# EAGLE schematic BasePCB (EAGLE 9.4.2)
Assembly variants: basic, pinout

## Sheet 1 of 2
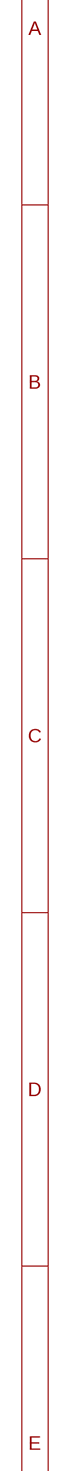
[diagram p0: schematic, sheet 1, part 1 of 2]
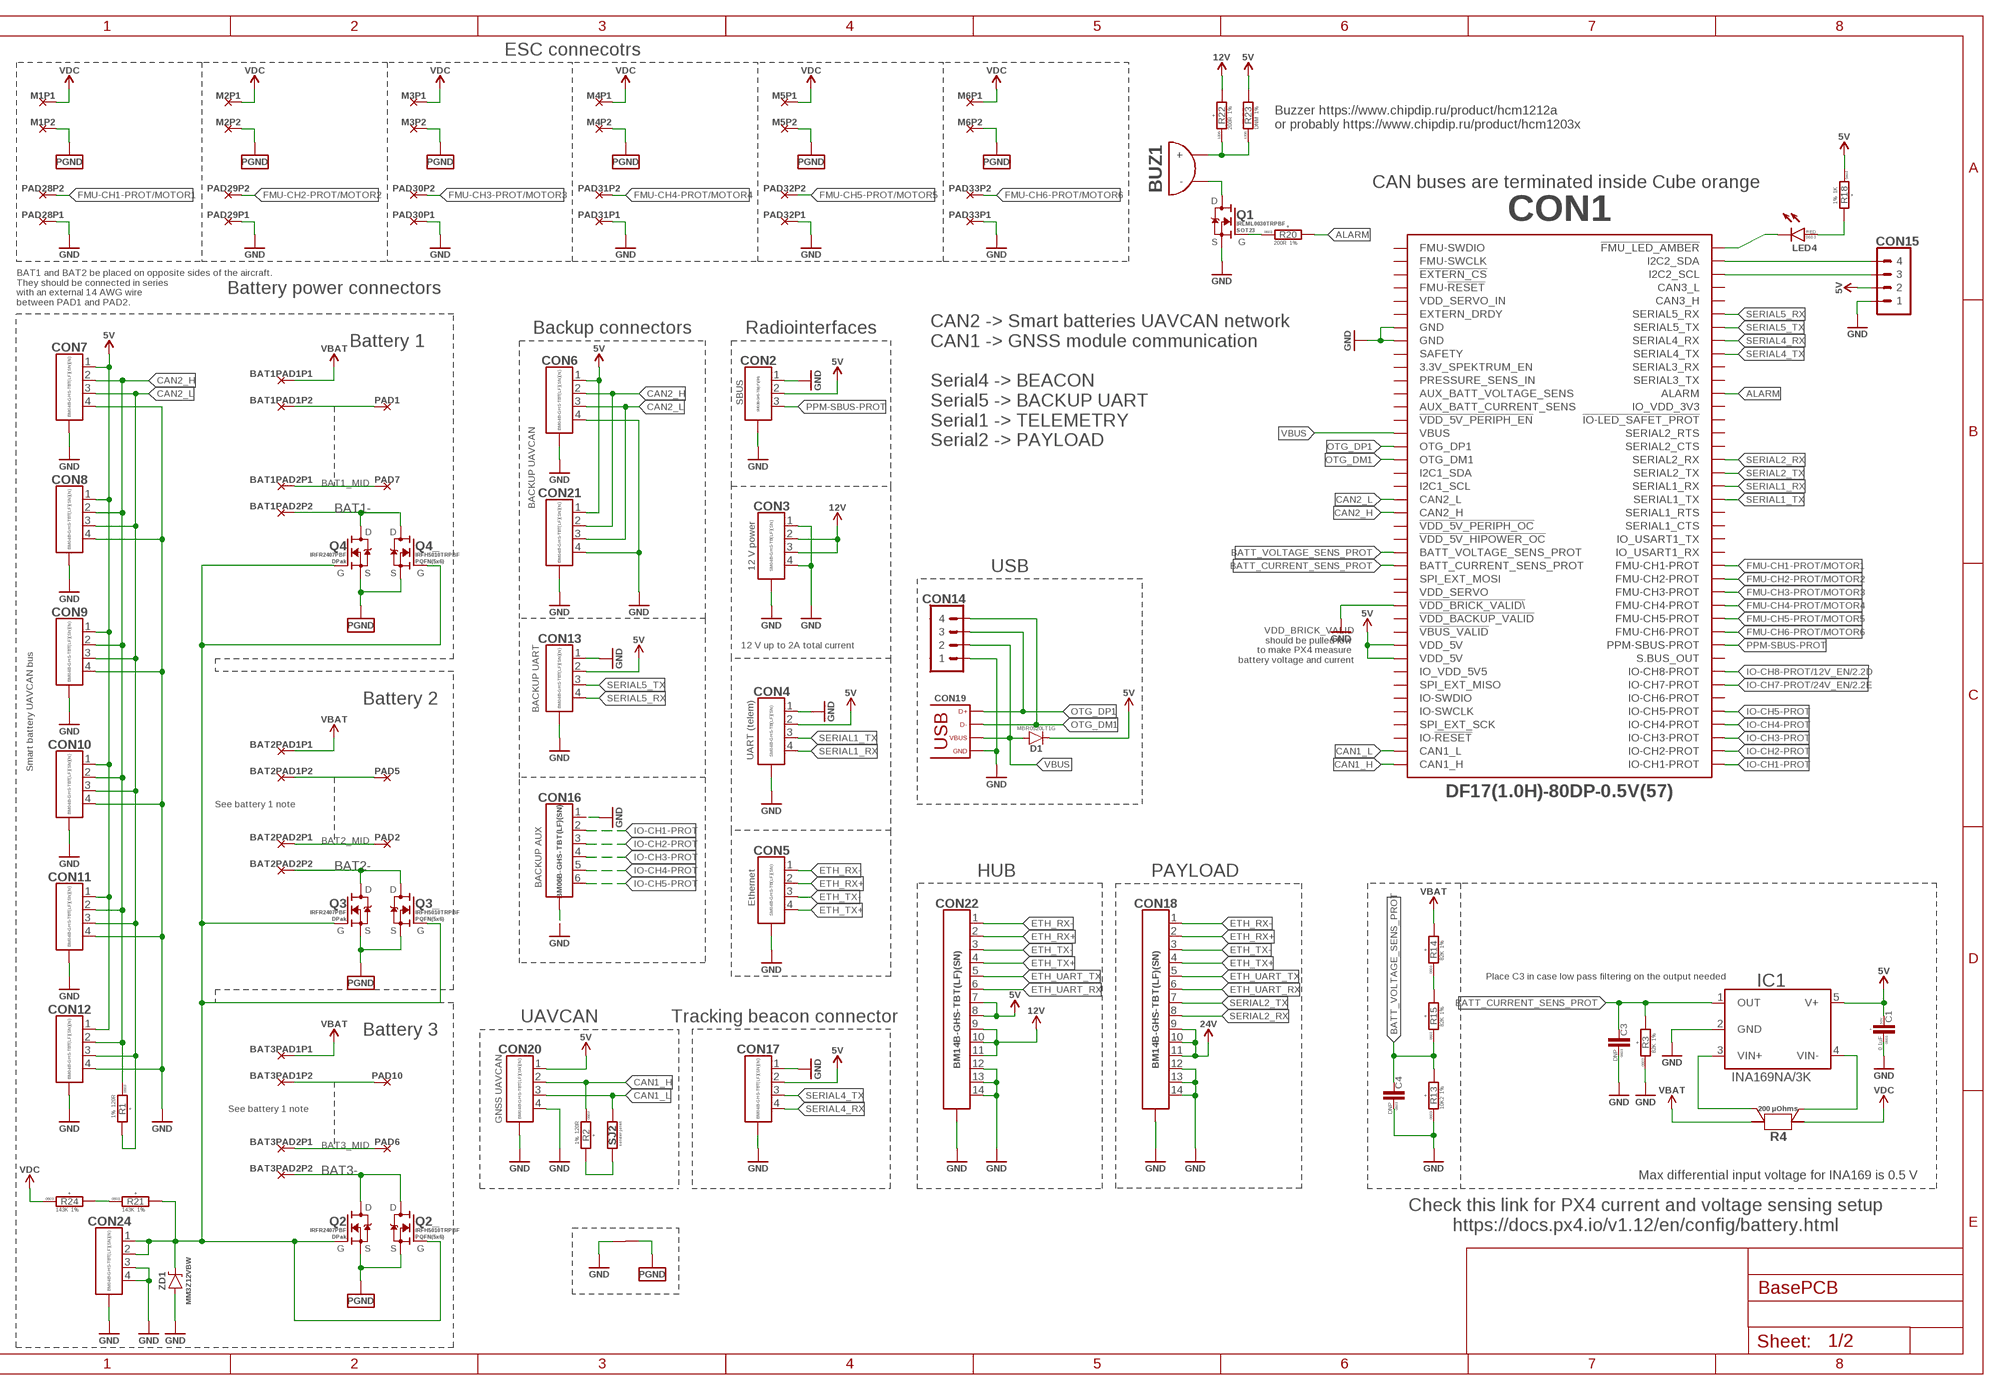
[diagram p1: schematic, sheet 1, part 2 of 2]

### Parts
BAT1PAD1  PAD_PAIR-4X10  [4X10_PAIR]  (not fitted in variant basic)  (not fitted in variant pinout)
BAT1PAD2  PAD_PAIR-4X10  [4X10_PAIR]  (not fitted in variant basic)  (not fitted in variant pinout)
BAT2PAD1  PAD_PAIR-4X10  [4X10_PAIR]  (not fitted in variant basic)  (not fitted in variant pinout)
BAT2PAD2  PAD_PAIR-4X10  [4X10_PAIR]  (not fitted in variant basic)  (not fitted in variant pinout)
BAT3PAD1  PAD_PAIR-4X10  [4X10_PAIR]  (not fitted in variant basic)  (not fitted in variant pinout)
BAT3PAD2  PAD_PAIR-4X10  [4X10_PAIR]  (not fitted in variant basic)  (not fitted in variant pinout)
BUZ1  BUZZER-ЕР-12MM  [BUZZER_12MM]  (not fitted in variant pinout)
C1  0.1uF  C-0603  [C0603]  (not fitted in variant pinout)
C3  DNP  C-0603  [C0603]  (not fitted in variant basic)  (not fitted in variant pinout)
C4  DNP  C-0603  [C0603]  (not fitted in variant basic)  (not fitted in variant pinout)
CON1  CUBE_ORANGE_  [CUBE_ORANGE]
CON2  CON-3P-TABS-JST-GH-SIDE  [SM03B-GHS-TB]
CON3  CON-4P-TABS-JST-GH-SIDE  [SM04B-GHS-TB]
CON4  CON-4P-TABS-JST-GH-SIDE  [SM04B-GHS-TB]
CON5  CON-4P-TABS-JST-GH-SIDE  [SM04B-GHS-TB]
CON6  CON-4P-TABS-JST-GH-TOP  [BM04B-GHS-TB]
CON7  CON-4P-TABS-JST-GH-TOP  [BM04B-GHS-TB]
CON8  CON-4P-TABS-JST-GH-TOP  [BM04B-GHS-TB]
CON9  CON-4P-TABS-JST-GH-TOP  [BM04B-GHS-TB]
CON10  CON-4P-TABS-JST-GH-TOP  [BM04B-GHS-TB]
CON11  CON-4P-TABS-JST-GH-TOP  [BM04B-GHS-TB]
CON12  CON-4P-TABS-JST-GH-TOP  [BM04B-GHS-TB]
CON13  CON-4P-TABS-JST-GH-TOP  [BM04B-GHS-TB]
CON14  PINHEAD_1X04-2.54  [1X04-PTH-2.54]  (not fitted in variant basic)  (not fitted in variant pinout)
CON15  PINHEAD_1X04-2.54  [1X04-PTH-2.54]  (not fitted in variant basic)  (not fitted in variant pinout)
CON16  CON-6P-TABS-JST-GH-TOP  [BM06B-GHS-TBT]
CON17  CON-4P-TABS-JST-GH-TOP  [BM04B-GHS-TB]
CON18  CON-14P-TABS-JST-GH-TOP  [BM14B-GHS-TBT]
CON19  USB-TYPE-C-VERT-PROD  [2047110001-PROD]
CON20  CON-4P-TABS-JST-GH-TOP  [BM04B-GHS-TB]
CON21  CON-4P-TABS-JST-GH-TOP  [BM04B-GHS-TB]
CON22  CON-14P-TABS-JST-GH-TOP  [BM14B-GHS-TBT]
CON24  CON-4P-TABS-JST-GH-TOP  [BM04B-GHS-TB]
D1  MBR0520L-SOD123  [SOD123]  (not fitted in variant pinout)
IC1  INA169  [SOT23-5]  (not fitted in variant pinout)
J1  CONNECTION-SMD-BIG  [CONNECTION_BIG]  (not fitted in variant basic)  (not fitted in variant pinout)
LED4  LED-0603  [LED0603]  (not fitted in variant pinout)
M1  PAD_PAIR-4X10  [4X10_PAIR]  (not fitted in variant basic)  (not fitted in variant pinout)
M2  PAD_PAIR-4X10  [4X10_PAIR]  (not fitted in variant basic)  (not fitted in variant pinout)
M3  PAD_PAIR-4X10  [4X10_PAIR]  (not fitted in variant basic)  (not fitted in variant pinout)
M4  PAD_PAIR-4X10  [4X10_PAIR]  (not fitted in variant basic)  (not fitted in variant pinout)
M5  PAD_PAIR-4X10  [4X10_PAIR]  (not fitted in variant basic)  (not fitted in variant pinout)
M6  PAD_PAIR-4X10  [4X10_PAIR]  (not fitted in variant basic)  (not fitted in variant pinout)
PAD1  PAD-10X4  [10X4]  (not fitted in variant basic)  (not fitted in variant pinout)
PAD2  PAD-10X4  [10X4]  (not fitted in variant basic)  (not fitted in variant pinout)
PAD5  PAD-10X4  [10X4]  (not fitted in variant basic)  (not fitted in variant pinout)
PAD6  PAD-10X4  [10X4]  (not fitted in variant basic)  (not fitted in variant pinout)
PAD7  PAD-10X4  [10X4]  (not fitted in variant basic)  (not fitted in variant pinout)
PAD10  PAD-10X4  [10X4]  (not fitted in variant basic)  (not fitted in variant pinout)
PAD28  PAD_PAIR-2X6  [2X6_PAIR]  (not fitted in variant basic)  (not fitted in variant pinout)
PAD29  PAD_PAIR-2X6  [2X6_PAIR]  (not fitted in variant basic)  (not fitted in variant pinout)
PAD30  PAD_PAIR-2X6  [2X6_PAIR]  (not fitted in variant basic)  (not fitted in variant pinout)
PAD31  PAD_PAIR-2X6  [2X6_PAIR]  (not fitted in variant basic)  (not fitted in variant pinout)
PAD32  PAD_PAIR-2X6  [2X6_PAIR]  (not fitted in variant basic)  (not fitted in variant pinout)
PAD33  PAD_PAIR-2X6  [2X6_PAIR]  (not fitted in variant basic)  (not fitted in variant pinout)
Q1  IRLML0030  [SOT23]  (not fitted in variant pinout)
Q2  IRFR2407PBF  [D-PAK]  (not fitted in variant basic)  (not fitted in variant pinout)
Q2_  IRFH5010TRPBF-DFN5X6  [PG-TDSON-8]  (not fitted in variant pinout)
Q3  IRFR2407PBF  [D-PAK]  (not fitted in variant basic)  (not fitted in variant pinout)
Q3_  IRFH5010TRPBF-DFN5X6  [PG-TDSON-8]  (not fitted in variant pinout)
Q4  IRFR2407PBF  [D-PAK]  (not fitted in variant basic)  (not fitted in variant pinout)
Q4_  IRFH5010TRPBF-DFN5X6  [PG-TDSON-8]  (not fitted in variant pinout)
R1  120R  R-1%-0603  [R0603]  (not fitted in variant pinout)
R2  120R  R-1%-0603  [R0603]  (not fitted in variant pinout)
R3  82K  R-1%-0603  [R0603]  (not fitted in variant pinout)
R4  200 µOhms  CURRENT_SHUNT_KELVIN-0.0002R-3920-KELVIN  [R3920-KELVIN]  (not fitted in variant pinout)
R13  10K2  R-1%-0603  [R0603]  (not fitted in variant pinout)
R14  82K  R-1%-0603  [R0603]  (not fitted in variant pinout)
R15  82K  R-1%-0603  [R0603]  (not fitted in variant pinout)
R18  1K  R-1%-0603  [R0603]  (not fitted in variant pinout)
R20  200R  R-1%-0603  [R0603]  (not fitted in variant pinout)
R21  143K  R-1%-0603  [R0603]  (not fitted in variant pinout)
R22  200R  R-1%-1206  [R1206]  (not fitted in variant pinout)
R23  DNM  R-1%-1206  [R1206]  (not fitted in variant basic)  (not fitted in variant pinout)
R24  143K  R-1%-0603  [R0603]  (not fitted in variant pinout)
SJ2  SOLDER_JOINT-SJ1  [RES_0]  (not fitted in variant basic)  (not fitted in variant pinout)
ZD1  MM3Z12VBW  [SOD323]  (not fitted in variant pinout)

### Nets
!FMU_LED_AMBER: CON1.2(!FMU_LED_AMBER) LED4.C
ALARM: CON1.24(ALARM) R20.2
BAT1-: BAT1PAD2.2 Q4.D Q4_.5D(D) Q4_.6D(D) Q4_.7D(D) Q4_.8D(D) Q4_.PAD_D(D)
BAT1_MID [HV]: BAT1PAD2.1 PAD7.P$1
BAT2-: BAT2PAD2.2 Q3.D Q3_.5D(D) Q3_.6D(D) Q3_.7D(D) Q3_.8D(D) Q3_.PAD_D(D)
BAT2_MID [HV]: BAT2PAD2.1 PAD2.P$1
BAT3-: BAT3PAD2.2 Q2.D Q2_.5D(D) Q2_.6D(D) Q2_.7D(D) Q2_.8D(D) Q2_.PAD_D(D)
BAT3_MID [HV]: BAT3PAD2.1 PAD6.P$1
BATT_CURRENT_SENS_PROT: C3.2 CON1.49(BATT_CURRENT_SENS_PROT) IC1.1(OUT) R3.2
BATT_VOLTAGE_SENS_PROT: C4.2 CON1.47(BATT_VOLTAGE_SENS_PROT) R13.2 R15.1
CAN1_H: CON1.79(CAN1_H) CON20.2 R2.1
CAN1_L: CON1.77(CAN1_L) CON20.3 SJ2.2
CAN2_H: CON1.41(CAN2_H) CON6.2 CON7.2 CON8.2 CON9.2 CON10.2 CON11.2 CON12.2 CON21.2 R1.1
CAN2_L: CON1.39(CAN2_L) CON6.3 CON7.3 CON8.3 CON9.3 CON10.3 CON11.3 CON12.3 CON21.3 R1.2
ETH_RX+: CON5.2 CON18.2 CON22.2
ETH_RX-: CON5.1 CON18.1 CON22.1
ETH_TX+: CON5.4 CON18.4 CON22.4
ETH_TX-: CON5.3 CON18.3 CON22.3
ETH_UART_RX: CON18.6 CON22.6
ETH_UART_TX: CON18.5 CON22.5
FMU-CH1-PROT/MOTOR1: CON1.50(FMU-CH1-PROT) PAD28.2
FMU-CH2-PROT/MOTOR2: CON1.52(FMU-CH2-PROT) PAD29.2
FMU-CH3-PROT/MOTOR3: CON1.54(FMU-CH3-PROT) PAD30.2
FMU-CH4-PROT/MOTOR4: CON1.56(FMU-CH4-PROT) PAD31.2
FMU-CH5-PROT/MOTOR5: CON1.58(FMU-CH5-PROT) PAD32.2
FMU-CH6-PROT/MOTOR6: CON1.60(FMU-CH6-PROT) PAD33.2
GND: C1.1 C3.1 C4.1 CON1.13(GND) CON1.15(GND) CON1.55(!VDD_BRICK_VALID\) CON2.1 CON2.M$0(GND) CON2.M$1(GND) CON3.1 CON3.4 CON3.M$0(GND) CON3.M$1(GND) CON4.1 CON4.M$0(GND) CON4.M$1(GND) CON5.M$0(GND) CON5.M$1(GND) CON6.4 CON6.M$0(GND) CON6.M$1(GND) CON7.4 CON7.M$0(GND) CON7.M$1(GND) CON8.4 CON8.M$0(GND) CON8.M$1(GND) CON9.4 CON9.M$0(GND) CON9.M$1(GND) CON10.4 CON10.M$0(GND) CON10.M$1(GND) CON11.4 CON11.M$0(GND) CON11.M$1(GND) CON12.4 CON12.M$0(GND) CON12.M$1(GND) CON13.1 CON13.M$0(GND) CON13.M$1(GND) CON14.1 CON15.1 CON16.1 CON16.M$0(G1) CON16.M$1(G1) CON17.1 CON17.M$0(GND) CON17.M$1(GND) CON18.12 CON18.13 CON18.14 CON18.M$0(G1) CON18.M$1(G1) CON19.A1(GND) CON19.A12(GND) CON19.B1(GND) CON19.B12(GND) CON19.G1(GND) CON19.G2(GND) CON19.G4(GND) CON19.G5(GND) CON19.G7(GND) CON19.G8(GND) CON19.G9(GND) CON19.G10(GND) CON19.P$1(GND) CON19.P$2(GND) CON20.4 CON20.M$0(GND) CON20.M$1(GND) CON21.4 CON21.M$0(GND) CON21.M$1(GND) CON22.12 CON22.13 CON22.14 CON22.M$0(G1) CON22.M$1(G1) CON24.3 CON24.4 CON24.M$0(GND) CON24.M$1(GND) IC1.2(GND) J1.1 PAD28.1 PAD29.1 PAD30.1 PAD31.1 PAD32.1 PAD33.1 Q1.2(S) R3.1 R13.1 ZD1.A ; also sheet 2
I2C2_SCL: CON1.6(I2C2_SCL) CON15.3
I2C2_SDA: CON1.4(I2C2_SDA) CON15.4
IO-CH1-PROT: CON1.80(IO-CH1-PROT) CON16.2
IO-CH2-PROT: CON1.78(IO-CH2-PROT) CON16.3
IO-CH3-PROT: CON1.76(IO-CH3-PROT) CON16.4
IO-CH4-PROT: CON1.74(IO-CH4-PROT) CON16.5
IO-CH5-PROT: CON1.72(IO-CH5-PROT) CON16.6
IO-CH7-PROT/24V_EN: CON1.68(IO-CH7-PROT) ; also sheet 2
IO-CH8-PROT/12V_EN: CON1.66(IO-CH8-PROT) ; also sheet 2
N$1: LED4.A R18.2
N$2: BAT1PAD1.2 PAD1.P$1
N$3: BUZ1.2(-) Q1.3(D)
N$4: BAT2PAD1.2 PAD5.P$1
N$5: Q1.1(G) R20.1
N$6: BAT3PAD1.2 PAD10.P$1
N$8: R2.2 SJ2.1
N$9: IC1.4(VIN-) R4.S2
N$10: IC1.3(VIN+) R4.S1
N$12: R14.1 R15.2
N$13: BUZ1.1(+) R22.P$1 R23.P$1
N$24: R21.1 R24.2
OTG_DM1: CON1.33(OTG_DM1) CON14.4 CON19.A7(D-) CON19.B7(D-)
OTG_DP1: CON1.31(OTG_DP1) CON14.3 CON19.A6(D+) CON19.B6(D+)
PGND: J1.2 M1.2 M2.2 M3.2 M4.2 M5.2 M6.2 Q2.S Q2_.1S(S) Q2_.2S(S) Q2_.3S(S) Q3.S Q3_.1S(S) Q3_.2S(S) Q3_.3S(S) Q4.S Q4_.1S(S) Q4_.2S(S) Q4_.3S(S)
PPM-SBUS-PROT: CON1.62(PPM-SBUS-PROT) CON2.3
PWR_GATE: CON24.1 CON24.2 Q2.G Q2_.4G(G) Q3.G Q3_.4G(G) Q4.G Q4_.4G(G) R21.2 ZD1.C
SERIAL1_RX: CON1.38(SERIAL1_RX) CON4.4
SERIAL1_TX: CON1.40(SERIAL1_TX) CON4.3
SERIAL2_RX: CON1.34(SERIAL2_RX) CON18.8
SERIAL2_TX: CON1.36(SERIAL2_TX) CON18.7
SERIAL4_RX: CON1.16(SERIAL4_RX) CON17.4
SERIAL4_TX: CON1.18(SERIAL4_TX) CON17.3
SERIAL5_RX: CON1.12(SERIAL5_RX) CON13.4
SERIAL5_TX: CON1.14(SERIAL5_TX) CON13.3
VBAT [HV]: BAT1PAD1.1 BAT2PAD1.1 BAT3PAD1.1 R4.1 R4.11 R14.2
VBUS: CON1.29(VBUS) CON14.2 CON19.A4(VBUS) CON19.B4(VBUS) D1.A
VDC [HV]: M1.1 M2.1 M3.1 M4.1 M5.1 M6.1 R4.2 R4.22 R24.1 ; also sheet 2
VDD_5V: C1.2 CON1.61(VDD_5V) CON1.63(VDD_5V) CON2.2 CON4.2 CON6.1 CON7.1 CON8.1 CON9.1 CON10.1 CON11.1 CON12.1 CON13.2 CON15.2 CON17.2 CON20.1 CON21.1 CON22.7 CON22.8 D1.C IC1.5(V+) R18.1 R23.P$2 ; supply symbol labelled 5V ; also sheet 2
VDD_12V: CON3.2 CON3.3 CON22.9 CON22.10 CON22.11 R22.P$2 ; supply symbol labelled 12V ; also sheet 2
VDD_24V: CON18.9 CON18.10 CON18.11 ; supply symbol labelled 24V ; also sheet 2
Unconnected: CON1.1(FMU-SWDIO) CON1.3(FMU-SWCLK) CON1.5(!EXTERN_CS) CON1.7(FMU-!RESET) CON1.8(CAN3_L) CON1.9(VDD_SERVO_IN) CON1.10(CAN3_H) CON1.11(EXTERN_DRDY) CON1.17(SAFETY) CON1.19(3.3V_SPEKTRUM_EN) CON1.20(SERIAL3_RX) CON1.21(PRESSURE_SENS_IN) CON1.22(SERIAL3_TX) CON1.23(AUX_BATT_VOLTAGE_SENS) CON1.25(AUX_BATT_CURRENT_SENS) CON1.26(IO_VDD_3V3) CON1.27(!VDD_5V_PERIPH_EN) CON1.28(!IO-LED_SAFET_PROT) CON1.30(SERIAL2_RTS) CON1.32(SERIAL2_CTS) CON1.35(I2C1_SDA) CON1.37(I2C1_SCL) CON1.42(SERIAL1_RTS) CON1.43(!VDD_5V_PERIPH_OC) CON1.44(SERIAL1_CTS) CON1.45(!VDD_5V_HIPOWER_OC) CON1.46(IO_USART1_TX) CON1.48(IO_USART1_RX) CON1.51(SPI_EXT_MOSI) CON1.53(VDD_SERVO) CON1.57(!VDD_BACKUP_VALID) CON1.59(!VBUS_VALID) CON1.64(S.BUS_OUT) CON1.65(IO_VDD_5V5) CON1.67(SPI_EXT_MISO) CON1.69(IO-SWDIO) CON1.70(IO-CH6-PROT) CON1.71(IO-SWCLK) CON1.73(SPI_EXT_SCK) CON1.75(IO-!RESET)

### Notes on the sheet
- ESC connecotrs
- Buzzer https://www.chipdip.ru/product/hcm1212a
  or probably https://www.chipdip.ru/product/hcm1203x
- CAN buses are terminated inside Cube orange
- BAT1 and BAT2 be placed on opposite sides of the aircraft.
  They should be connected in series
  with an external 14 AWG wire
  between PAD1 and PAD2.
- Battery power connectors
- Backup connectors | Radiointerfaces
- Battery 1
- CAN2 -> Smart batteries UAVCAN network
  CAN1 -> GNSS module communication
  
  Serial4 -> BEACON
  Serial5 -> BACKUP UART
  Serial1 -> TELEMETRY
  Serial2 -> PAYLOAD
- SBUS
- BACKUP UAVCAN
- 12 V power
- USB
- 12 V up to 2A total current
- VDD_BRICK_VALID
  should be pulled low 
  to make PX4 measure 
  battery voltage and current
- BACKUP UART
- Battery 2
- Smart battery UAVCAN bus
- UART (telem)
- See battery 1 note
- BACKUP AUX
- HUB | PAYLOAD
- Ethernet
- Place C3 in case low pass filtering on the output needed
- UAVCAN | Tracking beacon connector
- Battery 3
- GNSS UAVCAN
- See battery 1 note
- Max differential input voltage for INA169 is 0.5 V
- Check this link for PX4 current and voltage sensing setup
  https://docs.px4.io/v1.12/en/config/battery.html

## Sheet 2 of 2: DC-DC converters
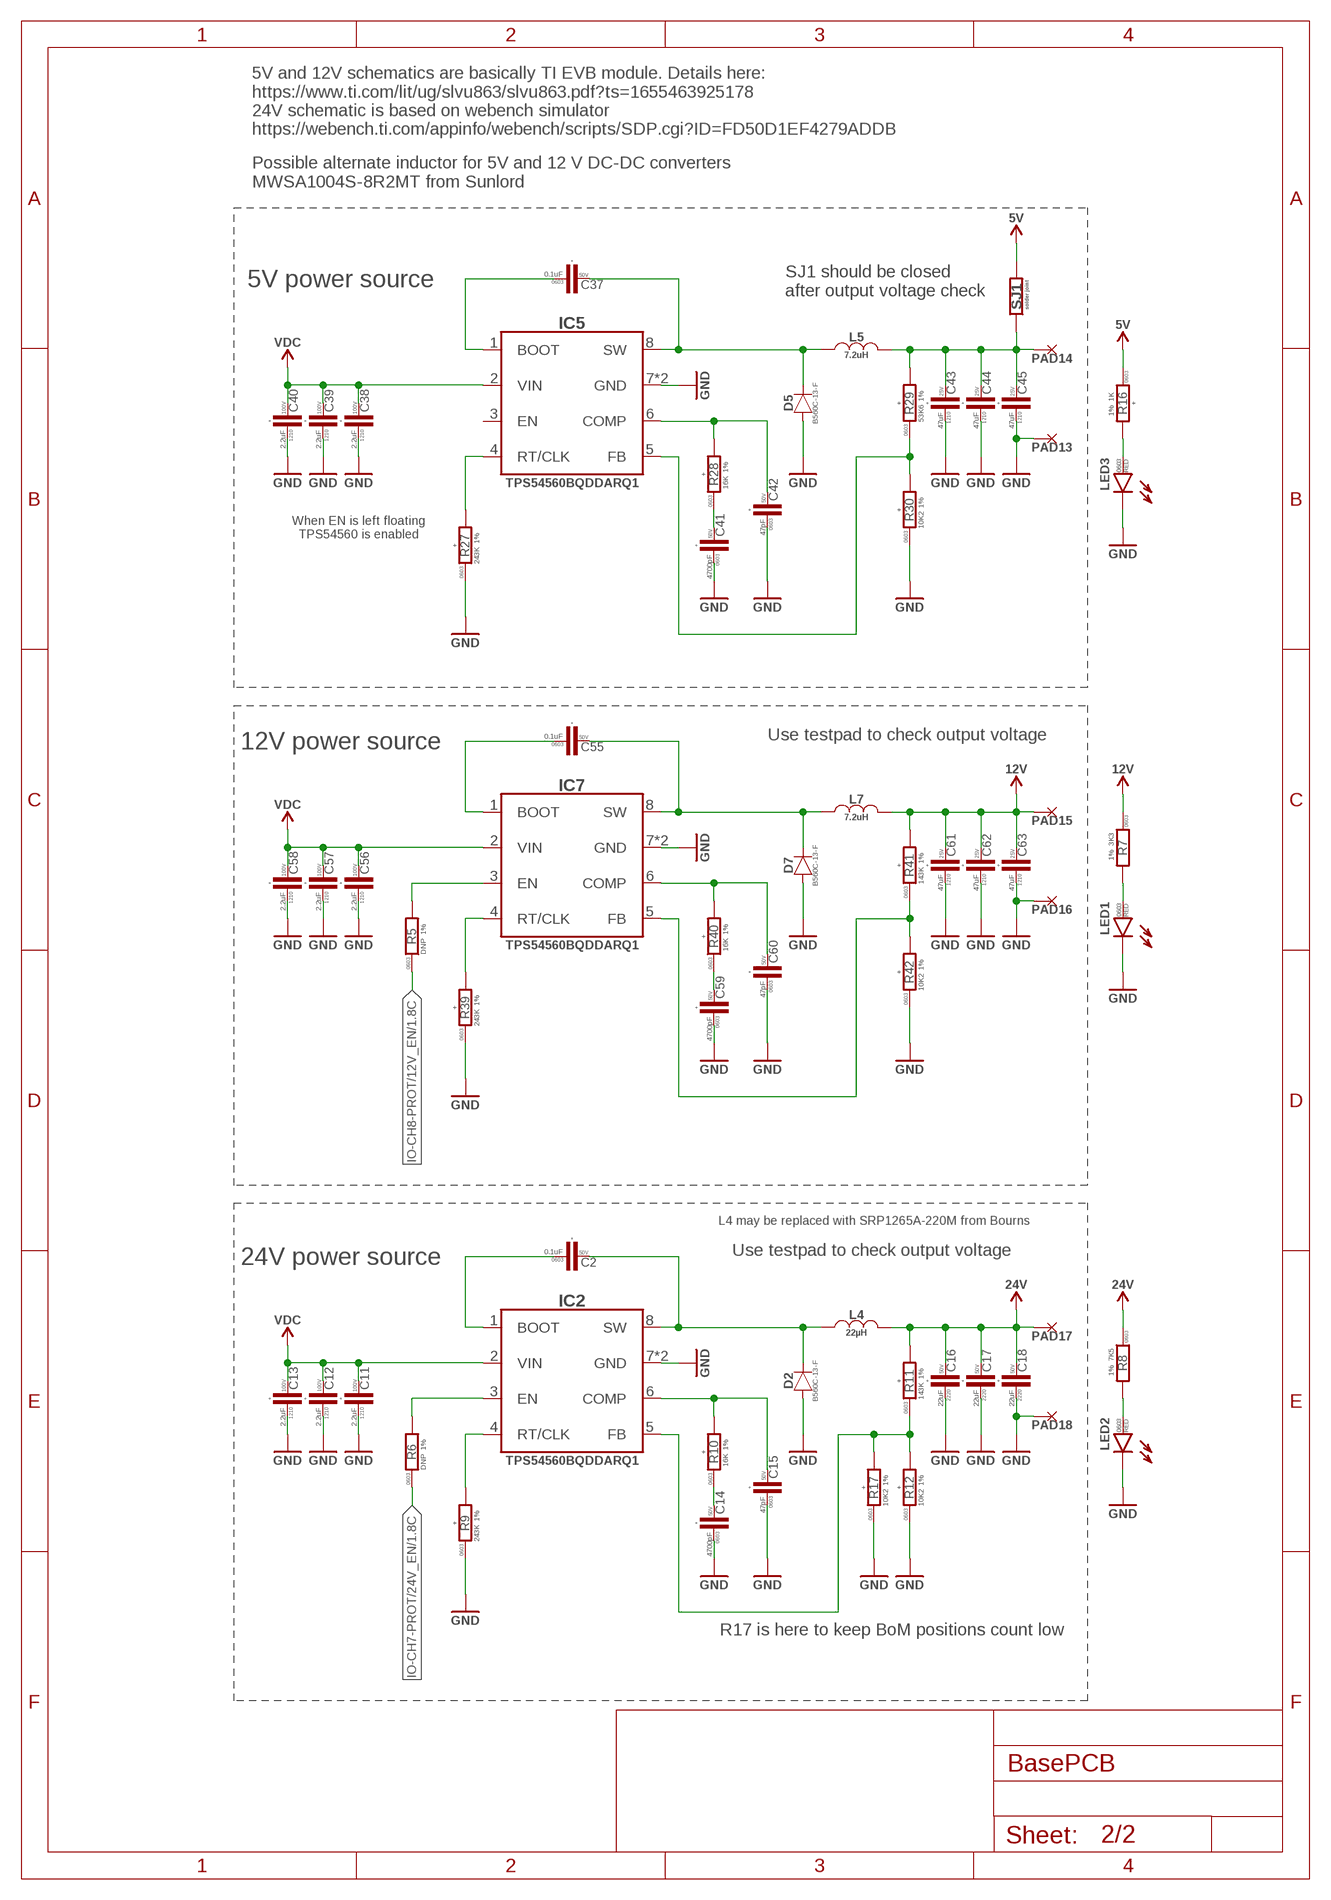
[diagram p2: schematic, sheet 2]

### Parts
C2  0.1uF  C-0603  [C0603]  (not fitted in variant pinout)
C11  2.2uF  C-1210  [C1210]  (not fitted in variant pinout)
C12  2.2uF  C-1210  [C1210]  (not fitted in variant pinout)
C13  2.2uF  C-1210  [C1210]  (not fitted in variant pinout)
C14  4700pF  C-0603  [C0603]  (not fitted in variant pinout)
C15  47pF  C-0603  [C0603]  (not fitted in variant pinout)
C16  22uF  C-C2220  [C2220]  (not fitted in variant pinout)
C17  22uF  C-C2220  [C2220]  (not fitted in variant pinout)
C18  22uF  C-C2220  [C2220]  (not fitted in variant pinout)
C37  0.1uF  C-0603  [C0603]  (not fitted in variant pinout)
C38  2.2uF  C-1210  [C1210]  (not fitted in variant pinout)
C39  2.2uF  C-1210  [C1210]  (not fitted in variant pinout)
C40  2.2uF  C-1210  [C1210]  (not fitted in variant pinout)
C41  4700pF  C-0603  [C0603]  (not fitted in variant pinout)
C42  47pF  C-0603  [C0603]  (not fitted in variant pinout)
C43  47uF  C-1210  [C1210]  (not fitted in variant pinout)
C44  47uF  C-1210  [C1210]  (not fitted in variant pinout)
C45  47uF  C-1210  [C1210]  (not fitted in variant pinout)
C55  0.1uF  C-0603  [C0603]  (not fitted in variant pinout)
C56  2.2uF  C-1210  [C1210]  (not fitted in variant pinout)
C57  2.2uF  C-1210  [C1210]  (not fitted in variant pinout)
C58  2.2uF  C-1210  [C1210]  (not fitted in variant pinout)
C59  4700pF  C-0603  [C0603]  (not fitted in variant pinout)
C60  47pF  C-0603  [C0603]  (not fitted in variant pinout)
C61  47uF  C-1210  [C1210]  (not fitted in variant pinout)
C62  47uF  C-1210  [C1210]  (not fitted in variant pinout)
C63  47uF  C-1210  [C1210]  (not fitted in variant pinout)
D2  B560C  [DO-214AB(SMC)]  (not fitted in variant pinout)
D5  B560C  [DO-214AB(SMC)]  (not fitted in variant pinout)
D7  B560C  [DO-214AB(SMC)]  (not fitted in variant pinout)
IC2  TPS54560B  [SOIC8-POWERPAD]  (not fitted in variant pinout)
IC5  TPS54560B  [SOIC8-POWERPAD]  (not fitted in variant pinout)
IC7  TPS54560B  [SOIC8-POWERPAD]  (not fitted in variant pinout)
L4  22µH  22µH-MWSA1206S  [MWSA1206S]  (not fitted in variant pinout)
L5  7.2uH  7.2µH-1064  [1064]  (not fitted in variant pinout)
L7  7.2uH  7.2µH-1064  [1064]  (not fitted in variant pinout)
LED1  LED-0603  [LED0603]  (not fitted in variant pinout)
LED2  LED-0603  [LED0603]  (not fitted in variant pinout)
LED3  LED-0603  [LED0603]  (not fitted in variant pinout)
PAD13  PAD-S_2X2  [2х2]  (not fitted in variant basic)  (not fitted in variant pinout)
PAD14  PAD-S_2X2  [2х2]  (not fitted in variant basic)  (not fitted in variant pinout)
PAD15  PAD-S_2X2  [2х2]  (not fitted in variant basic)  (not fitted in variant pinout)
PAD16  PAD-S_2X2  [2х2]  (not fitted in variant basic)  (not fitted in variant pinout)
PAD17  PAD-S_2X2  [2х2]  (not fitted in variant basic)  (not fitted in variant pinout)
PAD18  PAD-S_2X2  [2х2]  (not fitted in variant basic)  (not fitted in variant pinout)
R5  DNP  R-1%-0603  [R0603]  (not fitted in variant basic)  (not fitted in variant pinout)
R6  DNP  R-1%-0603  [R0603]  (not fitted in variant basic)  (not fitted in variant pinout)
R7  3K3  R-1%-0603  [R0603]  (not fitted in variant pinout)
R8  7K5  R-1%-0603  [R0603]  (not fitted in variant pinout)
R9  243K  R-1%-0603  [R0603]  (not fitted in variant pinout)
R10  16K  R-1%-0603  [R0603]  (not fitted in variant pinout)
R11  143K  R-1%-0603  [R0603]  (not fitted in variant pinout)
R12  10K2  R-1%-0603  [R0603]  (not fitted in variant pinout)
R16  1K  R-1%-0603  [R0603]  (not fitted in variant pinout)
R17  10K2  R-1%-0603  [R0603]  (not fitted in variant pinout)
R27  243K  R-1%-0603  [R0603]  (not fitted in variant pinout)
R28  16K  R-1%-0603  [R0603]  (not fitted in variant pinout)
R29  53K6  R-1%-0603  [R0603]  (not fitted in variant pinout)
R30  10K2  R-1%-0603  [R0603]  (not fitted in variant pinout)
R39  243K  R-1%-0603  [R0603]  (not fitted in variant pinout)
R40  16K  R-1%-0603  [R0603]  (not fitted in variant pinout)
R41  143K  R-1%-0603  [R0603]  (not fitted in variant pinout)
R42  10K2  R-1%-0603  [R0603]  (not fitted in variant pinout)
SJ1  SOLDER_JOINT-SJ1  [RES_0]  (not fitted in variant basic)  (not fitted in variant pinout)

### Nets
GND: C11.1 C12.1 C13.1 C14.1 C15.1 C16.P$1 C17.P$1 C18.P$1 C38.1 C39.1 C40.1 C41.1 C42.1 C43.1 C44.1 C45.1 C56.1 C57.1 C58.1 C59.1 C60.1 C61.1 C62.1 C63.1 D2.A D5.A D7.A IC2.7(GND) IC2.P$1(GND) IC5.7(GND) IC5.P$1(GND) IC7.7(GND) IC7.P$1(GND) LED1.C LED2.C LED3.C PAD13.P$1 PAD16.P$1 PAD18.P$1 R9.1 R12.1 R17.1 R27.1 R30.1 R39.1 R42.1 ; also sheet 1
IO-CH7-PROT/24V_EN: R6.1 ; also sheet 1
IO-CH8-PROT/12V_EN: R5.1 ; also sheet 1
N$7: C43.2 C44.2 C45.2 L5.2 PAD14.P$1 R29.2 SJ1.1
N$11: IC7.3(EN) R5.2
N$14: C2.1 IC2.1(BOOT)
N$15: C2.2 D2.C IC2.8(SW) L4.1
N$16: IC2.4(RT/CLK) R9.2
N$17: IC2.3(EN) R6.2
N$18: C15.2 IC2.6(COMP) R10.2
N$19: C14.2 R10.1
N$20: IC2.5(FB) R11.1 R12.2 R17.2
N$21: LED1.A R7.2
N$22: LED2.A R8.2
N$23: LED3.A R16.2
N$35: C37.1 IC5.1(BOOT)
N$36: C37.2 D5.C IC5.8(SW) L5.1
N$37: IC5.4(RT/CLK) R27.2
N$39: C42.2 IC5.6(COMP) R28.2
N$40: C41.2 R28.1
N$41: IC5.5(FB) R29.1 R30.2
N$49: C55.1 IC7.1(BOOT)
N$50: C55.2 D7.C IC7.8(SW) L7.1
N$51: IC7.4(RT/CLK) R39.2
N$53: C60.2 IC7.6(COMP) R40.2
N$54: C59.2 R40.1
N$55: IC7.5(FB) R41.1 R42.2
VDC [HV]: C11.2 C12.2 C13.2 C38.2 C39.2 C40.2 C56.2 C57.2 C58.2 IC2.2(VIN) IC5.2(VIN) IC7.2(VIN) ; also sheet 1
VDD_5V: R16.1 SJ1.2 ; supply symbol labelled 5V ; also sheet 1
VDD_12V: C61.2 C62.2 C63.2 L7.2 PAD15.P$1 R7.1 R41.2 ; supply symbol labelled 12V ; also sheet 1
VDD_24V: C16.P$2 C17.P$2 C18.P$2 L4.2 PAD17.P$1 R8.1 R11.2 ; supply symbol labelled 24V ; also sheet 1
Unconnected: IC5.3(EN)

### Notes on the sheet
- 5V and 12V schematics are basically TI EVB module. Details here:
  https://www.ti.com/lit/ug/slvu863/slvu863.pdf?ts=1655463925178
  24V schematic is based on webench simulator
  https://webench.ti.com/appinfo/webench/scripts/SDP.cgi?ID=FD50D1EF4279ADDB
- Possible alternate inductor for 5V and 12 V DC-DC converters
  MWSA1004S-8R2MT from Sunlord
- 5V power source
- SJ1 should be closed
  after output voltage check
- When EN is left floating
  TPS54560 is enabled
- 12V power source | Use testpad to check output voltage
- L4 may be replaced with SRP1265A-220M from Bourns
- 24V power source | Use testpad to check output voltage
- R17 is here to keep BoM positions count low

## Library data of the parts
BAT1PAD1 BAT1PAD2 BAT2PAD1 BAT2PAD2 BAT3PAD1 BAT3PAD2 M1-M6 PAD28-PAD33 = PADS:PAD_PAIR
BUZ1 = misc:BUZZER; MANF: JL World; MANF#: HCM1212A
C1 C2 C37 C55 = rc:C; ALLOCATED: +; LCSC#: C14663; MANF: YAGEO; MANF#: CC0603KRX7R9BB104; PACKAGE: 0603; VOLTAGE: 50V
C3 C4 = rc:C; PACKAGE: 0603
C11-C13 C38-C40 C56-C58 = rc:C; ALLOCATED: +; LCSC#: C55151; MANF: Samsung Electro-Mechanics; MANF#: CL32B225KCJSNNE; PACKAGE: 1210; VOLTAGE: 100V
C14 C41 C59 = rc:C; ALLOCATED: +; LCSC#: C53987; MANF: FH(Guangdong Fenghua Advanced Tech); MANF#: 0603B472K500NT; PACKAGE: 0603; VOLTAGE: 50V
C15 C42 C60 = rc:C; ALLOCATED: +; LCSC#: C1671; MANF: Samsung Electro-Mechanics; MANF#: CL10C470JB8NNNC; PACKAGE: 0603; VOLTAGE: 50V
C16-C18 = rc:C; ALLOCATED: +; LCSC#: C784103; MANF: PSA(Prosperity Dielectrics); MANF#: FS55X226K500EHG; PACKAGE: 2220; VOLTAGE: 50V
C43-C45 C61-C63 = rc:C; ALLOCATED: +; LCSC#: C90142; MANF: Taiyo Yuden; MANF#: TMK325ABJ476MM-P; PACKAGE: 1210; VOLTAGE: 25V
CON1 = misc:CUBE_ORANGE; MANF: HIROSE; MANF#: DF17(1.0H)-80DP-0.5V(57)
CON2 = Connectors:CON-3P-TABS; ENTRY: SIDE; LCSC#: C514175; MANF: JST Sales America Inc; MANF#: SM03B-GHS-TB(LF)(SN)
CON3-CON5 = Connectors:CON-4P-TABS: Connector Receptacle 4 Position; DIGIKEY#: 455-1566-1-ND; ENTRY: SIDE; LCSC#: C189895; MANF: JST Sales America Inc; MANF#: SM04B-GHS-TB(LF)(SN); OPERATING_TEMP: -25°C ~ 85°C
CON6-CON13 CON17 CON20 CON21 CON24 = Connectors:CON-4P-TABS: Connector Receptacle 4 Position; DIGIKEY#: 455-1580-2-ND; ENTRY: TOP; LCSC#: C161692; MANF: JST Sales America Inc; MANF#: BM04B-GHS-TBT(LF)(SN)(N); OPERATING_TEMP: -25°C ~ 85°C
CON14 CON15 = pinhead:PINHEAD_1X04
CON16 = Connectors:CON-6P-TABS: CONN HEADER 6 POS; ENTRY: TOP; LCSC#: C495534; MANF: JST Sales America Inc; MANF#: BM06B-GHS-TBT(LF)(SN)
CON18 CON22 = Connectors:CON-14P-TABS; ENTRY: TOP; LCSC#: C265384; MANF: JST Sales America; MANF#: BM14B-GHS-TBT(LF)(SN)
CON19 = Connectors:USB: Connector Receptacle USB 2; LCSC#: C381139; MANF: Molex; MANF#: 2047110001
D1 = Diodes:MBR0520L: DIODE SCHOTTKY 20V 500MA SOD123; DIGIKEY#: MBR0520LT1GOSTR-ND; LCSC#: C23848; MANF: ON Semiconductor; MANF#: MBR0520LT1G
D2 D5 D7 = Diodes:B560C: 60V 700mV@5A 5A SMC(DO-214AB) Schottky Barrier Diodes (SBD) ROHS; LCSC#: C85100; MANF: Diodes Incorporated; MANF#: B560C-13-F
IC1 = misc:INA169: High-Side Measurement Current Shunt Monitor; LCSC#: C44322; MANF: Texas Instruments; MANF#: INA169NA/3K
IC2 IC5 IC7 = dc-dc:TPS54560B: Switching Voltage Regulators 4.5V to 60V Input, 5A, Step-Down DC-DC Converter with Eco-mode™ 8-SO PowerPAD -40 to 125 Datasheet <https://www.ti.com/lit/ds/symlink/tps54560b.pdf?ts=1655463669009>; LCSC#: C1355654; MANF: Texas Instruments; MANF#: TPS54560BQDDARQ1
J1 = misc:CONNECTION
L4 = power_inductors:22µH: Wirewound Inductor; DC_RESISTANCE: 39.5 mOhm; LCSC#: C408528; MANF: SUNLORD; MANF#: MWSA1206S-220MT; RATED_CURRENT: 7A
L5 L7 = power_inductors:7.2µH; DC_RESISTANCE: 11.3 mOhm; MANF: Wurth Elektronik; MANF#: 7447798720; RATED_CURRENT: 7.9A
LED1-LED4 = rc:LED: Light emitting diode; COLOR: RED; LCSC#: C2286; MANF: Hubei KENTO Elec; MANF#: KT-0603R; PACKAGE: 0603
PAD1 PAD2 PAD5-PAD7 PAD10 = PADS:PAD
PAD13-PAD18 = PADS:PAD; BOM: EXCLUDE
Q1 = mosfet:IRLML0030: MOSFET N-CH 30V 5.3A SOT-23-3; DIGIKEY#: IRLML0030TRPBFTR-ND; LCSC#: C3647050; MANF: Infineon Technologies; MANF#: IRLML0030TRPBF; PACKAGE: SOT23
Q2-Q4 = mosfet:IRFR2407PBF: N-Channel 75V 42A power MOSFET, Rdson = 0.026 Ohm; LCSC#: C40514; MANF: International Rectifier; MANF#: IRFR2407PBF; PACKAGE: DPak
Q2_ Q3_ Q4_ = mosfet:IRFH5010TRPBF: Vds = 100 V, Rdson = 9 mOhm; LCSC#: C495806; MANF: Infineon; MANF#: IRFH5010TRPBF; PACKAGE: PQFN(5x6)
R1 R2 = rc:R; ALLOCATED: +; LCSC#: C22787; MANF: UNI-ROYAL(Uniroyal Elec); MANF#: 0603WAF1200T5E; PACKAGE: 0603; TOLERANCE: 1%
R3 R14 R15 = rc:R; ALLOCATED: +; LCSC#: C23254; MANF: UNI-ROYAL(Uniroyal Elec); MANF#: 0603WAF8202T5E; PACKAGE: 0603; TOLERANCE: 1%
R4 = SHUNT_RESISTORS:CURRENT_SHUNT_KELVIN; DIGIKEY#: CSS2H-3920R-L200FCT-ND; MANF: Bourns Inc; MANF#: CSS2H-3920R-L200FCT-ND; OPERATING_TEMP: -55°C ~ 170°C; PACKAGE: 3920; POWER: 12W; TC: ±50ppm/°C; TOLERANCE: ±1%
R5 R6 = rc:R; PACKAGE: 0603; TOLERANCE: 1%
R7 = rc:R; LCSC#: C22978; MANF: UNI-ROYAL(Uniroyal Elec); MANF#: 0603WAF3301T5E; PACKAGE: 0603; TOLERANCE: 1%
R8 = rc:R; LCSC#: C23234; MANF: UNI-ROYAL(Uniroyal Elec); MANF#: 0603WAF7501T5E; PACKAGE: 0603; TOLERANCE: 1%
R9 R27 R39 = rc:R; ALLOCATED: +; LCSC#: C23351; MANF: UNI-ROYAL(Uniroyal Elec); MANF#: 0603WAF2433T5E; PACKAGE: 0603; TOLERANCE: 1%
R10 R28 R40 = rc:R; ALLOCATED: +; LCSC#: C4210; MANF: UNI-ROYAL(Uniroyal Elec); MANF#: 0603WAF1602T5E; PACKAGE: 0603; TOLERANCE: 1%
R11 R21 R24 R41 = rc:R; ALLOCATED: +; LCSC#: C22877; MANF: UNI-ROYAL(Uniroyal Elec); MANF#: 0603WAF1433T5E; PACKAGE: 0603; TOLERANCE: 1%
R12 R13 R17 R30 R42 = rc:R; ALLOCATED: +; LCSC#: C22772; MANF: UNI-ROYAL(Uniroyal Elec); MANF#: 0603WAF1022T5E; PACKAGE: 0603; TOLERANCE: 1%
R16 R18 R20 = rc:R; ALLOCATED: +; LCSC#: C21190; MANF: UNI-ROYAL(Uniroyal Elec); MANF#: 0603WAF1001T5E; PACKAGE: 0603; TOLERANCE: 1%
R22 = rc:R; ALLOCATED: +; LCSC#: C25361; MANF: UNI-ROYAL; MANF#: 1206W4J0201T5E; PACKAGE: 1206; TOLERANCE: 1%
R23 = rc:R; PACKAGE: 1206; TOLERANCE: 1%
R29 = rc:R; ALLOCATED: +; LCSC#: C23074; MANF: UNI-ROYAL(Uniroyal Elec); MANF#: 0603WAF5362T5E; PACKAGE: 0603; TOLERANCE: 1%
SJ1 SJ2 = misc:SOLDER_JOINT
ZD1 = Diodes:MM3Z12VBW: Zener Diode 12V 300mW ±6% Surface Mount SOD-323; LCSC#: C261275; MANF: Tak Cheong; MANF#: MM3Z12VBW

## Net classes
1 HV: clearance 0.5 mm to class 0, clearance 0.5 mm